# EAGLE design Controller Board v5 (EAGLE 5.06)
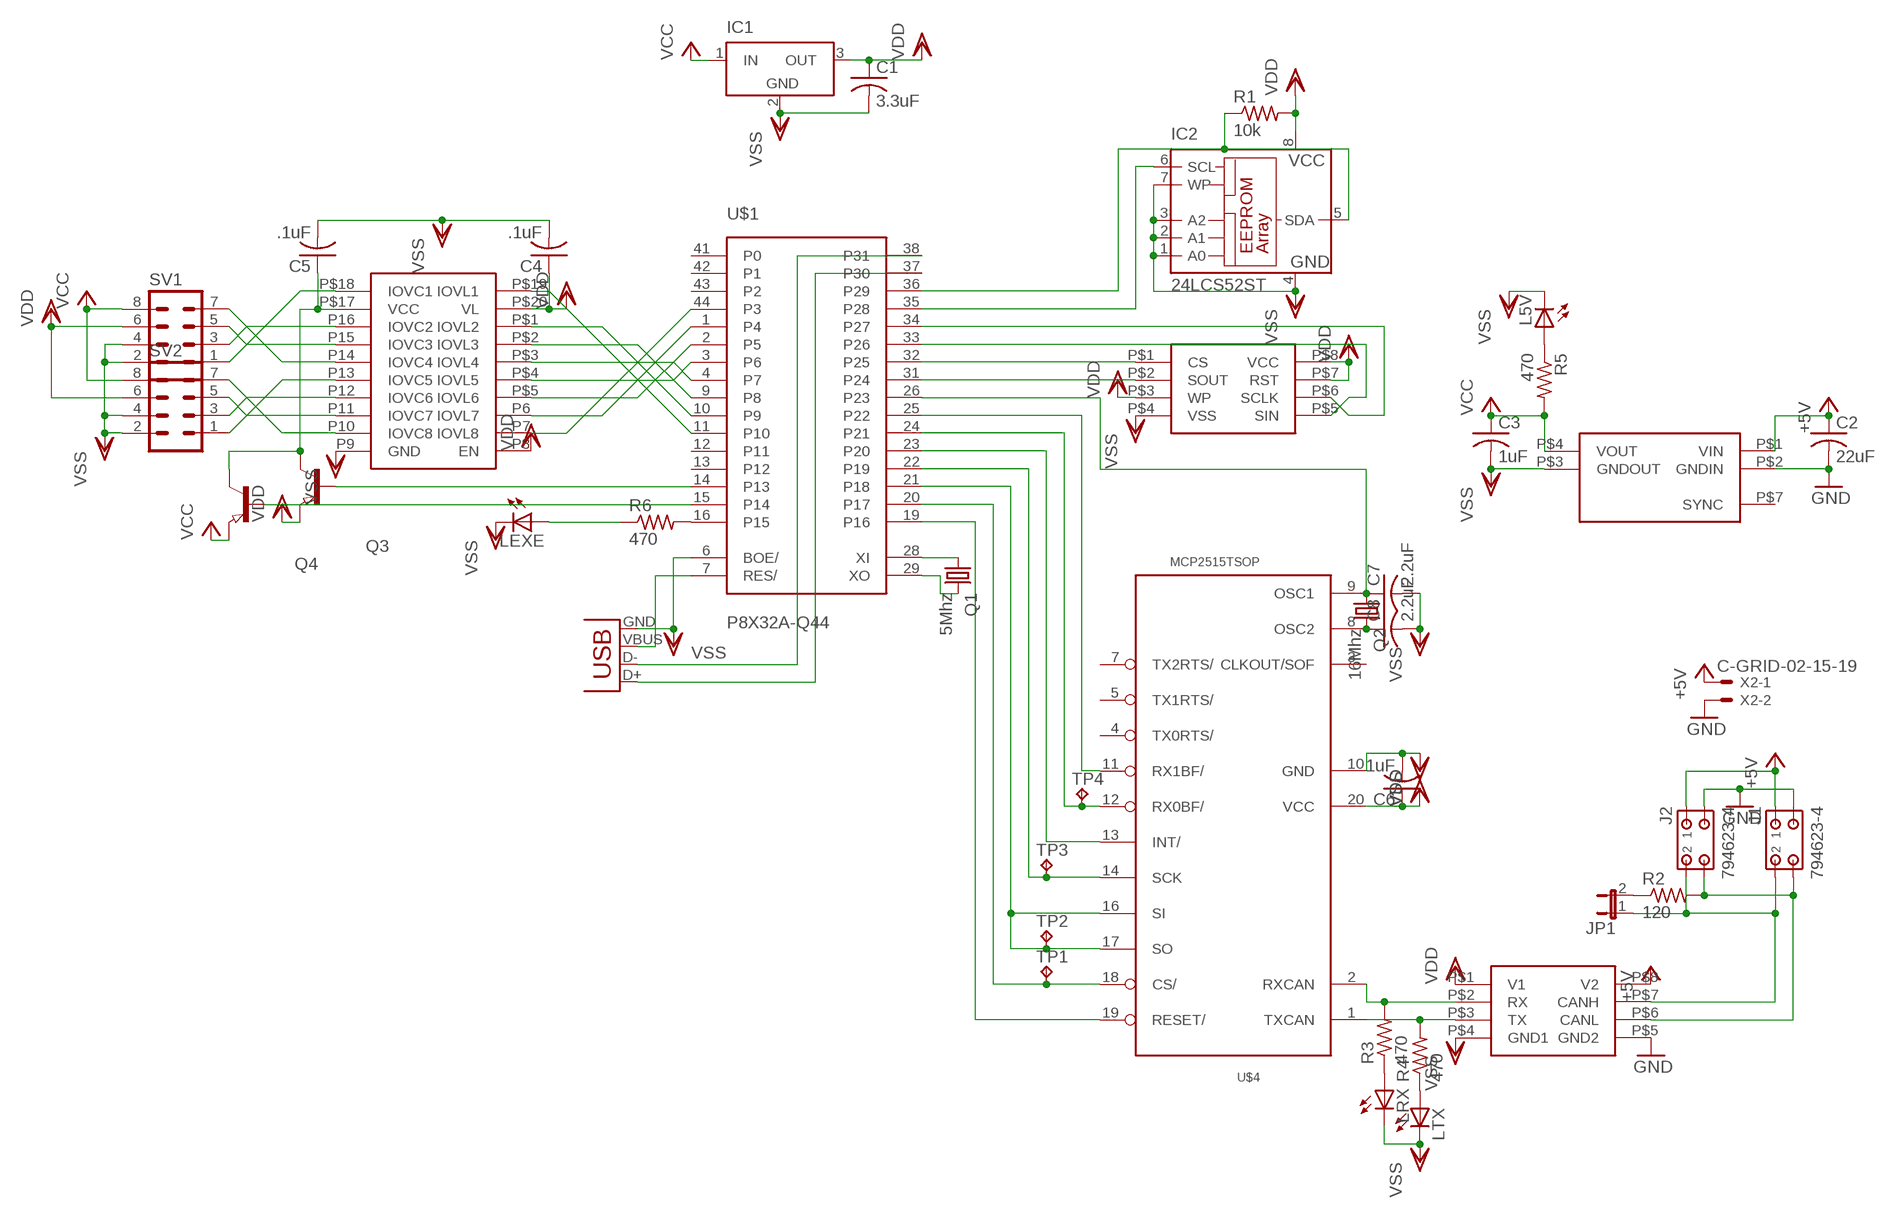
[diagram p0: schematic, sheet 1]

## Parts
C1  3.3uF  C-USC0805  [C0805]
C2  22uF  C-US050-024X044  [C050-024X044]
C3  1uF  C-USC0805  [C0805]
C4  .1uF  C-USC0805  [C0805]
C5  .1uF  C-USC0805  [C0805]
C6  1uF  C-USC0805  [C0805]
C7  2.2uF  C-USC0805  [C0805]
C8  2.2uF  C-USC0805  [C0805]
IC1  LT1129CST5  [SOT223]
IC2  24LCS52ST  [TSSOP8]
J1  794623-4  [794623-4]
J2  794623-4  [794623-4]
JP1  JP1E  [JP1]
L5V  LEDCHIP-LED0805  [CHIP-LED0805]
LEXE  LEDCHIP-LED0805  [CHIP-LED0805]
LRX  LEDCHIP-LED0805  [CHIP-LED0805]
LTX  LEDCHIP-LED0805  [CHIP-LED0805]
Q1  5Mhz  CRYSTALHC49UP  [HC49UP]
Q2  16Mhz  CRYSTALHC49UP  [HC49UP]
Q3  PNP-TRANSISTOR_SOT23  [SOT23]
Q4  PNP-TRANSISTOR_SOT23  [SOT23]
R1  10k  R-US_R0603  [R0603]
R2  120  R-US_R0603  [R0603]
R3  470  R-US_R0603  [R0603]
R4  470  R-US_R0603  [R0603]
R5  470  R-US_R0603  [R0603]
R6  470  R-US_R0603  [R0603]
SV1  MA04-2  [MA04-2]
SV2  MA04-2  [MA04-2]
TP1  TPPAD1-13  [P1-13]
TP2  TPPAD1-13  [P1-13]
TP3  TPPAD1-13  [P1-13]
TP4  TPPAD1-13  [P1-13]
U$1  P8X32A-Q44  [P8X32A-Q44]
U$2  TI-DCP020505  [PDIP14-7]
U$3  TI-ISO1050  [DUB-8]
U$4  MCP2515TSOP  [TSSOP20]
U$5  M25PE20  [S08N]
U$6  MAX3000E  [TQFN-20]
X1  USBSMD  [USB-MINIB]
X2  C-GRID-02-15-19  [15-91-02]

## Nets
+5V: C2.1 J1.1 J2.1 U$2.P$1(VIN) U$3.P$8(V2) X2.1
FLASHCLK: U$1.34(P27) U$5.P$6(SCLK)
FLASHSIN: U$1.33(P26) U$5.P$5(SIN)
GND: C2.2 J1.3 J2.3 U$2.P$2(GNDIN) U$3.P$5(GND2) X2.2
N$1: Q1.1 U$1.28(XI)
N$2: Q1.2 U$1.29(XO)
N$3: IC2.6(SCL) U$1.35(P28)
N$4: IC2.5(SDA) R1.1 U$1.36(P29)
N$5: U$1.7(RES/) X1.VBUS
N$6: U$1.38(P31) X1.D-
N$7: U$1.37(P30) X1.D+
N$8: U$1.25(P22) U$4.11(RX1BF/)
N$9: TP4.1(TP) U$1.24(P21) U$4.12(RX0BF/)
N$10: J1.4 J2.4 R2.2 U$3.P$6(CANL)
N$11: J1.2 J2.2 JP1.1 U$3.P$7(CANH)
N$14: U$1.32(P25) U$5.P$1(CS)
N$15: U$1.31(P24) U$5.P$2(SOUT)
N$16: U$1.23(P20) U$4.13(INT/)
N$17: TP3.1(TP) U$1.22(P19) U$4.14(SCK)
N$18: C7.1 Q2.1 U$1.26(P23) U$4.9(OSC1)
N$19: C8.1 Q2.2 U$4.8(OSC2)
N$20: R3.2 U$3.P$2(RX) U$4.2(RXCAN)
N$21: R4.2 U$3.P$3(TX) U$4.1(TXCAN)
N$22: JP1.2 R2.1
N$23: TP2.1(TP) U$1.21(P18) U$4.16(SI) U$4.17(SO)
N$24: TP1.1(TP) U$1.20(P17) U$4.18(CS/)
N$25: U$1.19(P16) U$4.19(RESET/)
N$26: LRX.A R3.1
N$27: U$1.11(P10) U$6.P$19(IOVL1)
N$28: SV2.7 U$6.P10(IOVC8)
N$29: SV2.5 U$6.P11(IOVC7)
N$30: U$1.10(P9) U$6.P$1(IOVL2)
N$31: U$1.9(P8) U$6.P$2(IOVL3)
N$32: U$1.4(P7) U$6.P$3(IOVL4)
N$33: U$1.3(P6) U$6.P$4(IOVL5)
N$34: U$1.2(P5) U$6.P$5(IOVL6)
N$35: U$1.1(P4) U$6.P6(IOVL7)
N$36: U$1.44(P3) U$6.P7(IOVL8)
N$37: SV2.3 U$6.P12(IOVC6)
N$38: SV2.1 U$6.P13(IOVC5)
N$39: SV1.7 U$6.P14(IOVC4)
N$40: SV1.1 U$6.P$18(IOVC1)
N$41: SV1.3 U$6.P16(IOVC2)
N$42: SV1.5 U$6.P15(IOVC3)
N$43: Q3.1(B) U$1.14(P13)
N$44: Q4.1(B) U$1.15(P14)
N$45: C5.1 Q3.3(C) Q4.3(C) U$6.P$17(VCC)
N$46: LTX.A R4.1
N$47: L5V.A R5.1
N$48: LEXE.A R6.1
N$49: R6.2 U$1.16(P15)
VCC: C3.1 IC1.1(IN) Q4.2(E) R5.2 SV1.8 SV2.8 U$2.P$4(VOUT)
VDD: C1.1 C4.1 C6.1 IC1.3(OUT) IC2.8(VCC) Q3.2(E) R1.2 SV1.6 SV2.6 U$3.P$1(V1) U$4.20(VCC) U$5.P$3(WP) U$5.P$7(RST) U$5.P$8(VCC) U$6.P8(EN) U$6.P$20(VL)
VSS: C1.2 C3.2 C4.2 C5.2 C6.2 C7.2 C8.2 IC1.2(GND) IC2.1(A0) IC2.2(A1) IC2.3(A2) IC2.4(GND) IC2.7(WP) L5V.C LEXE.C LRX.C LTX.C SV1.2 SV1.4 SV2.2 SV2.4 U$1.6(BOE/) U$2.P$3(GNDOUT) U$3.P$4(GND1) U$4.10(GND) U$5.P$4(VSS) U$6.P9(GND) X1.GND
Unconnected: U$1.12(P11) U$1.13(P12) U$1.41(P0) U$1.42(P1) U$1.43(P2) U$2.P$7(SYNC) U$4.3(CLKOUT/SOF) U$4.4(TX0RTS/) U$4.5(TX1RTS/) U$4.7(TX2RTS/)

## Power pins joined to a net without a drawn wire
VDD: U$1.8(VDD) U$1.18(VDD) U$1.30(VDD) U$1.40(VDD)
VSS: IC1.4(GND) U$1.5(VSS) U$1.17(VSS) U$1.27(VSS) U$1.39(VSS)

## Library data of the parts
C1-C8 = rcl:C-US: CAPACITOR, American symbol
IC1 = linear-technology:LT1129CST5: VOLTAGE REGULATOR with shutdown
IC2 = microchip:24*: Serial EEPROM I2C
J1 J2 = con-amp:794623-4: MICRO MATE N LOK Dual Row, grid 1.5 mm Source: http://catalog.tycoelectronics.com .. ENG_CD_794623_F.pdf
JP1 = jumper:JP1E: JUMPER
L5V LEXE LRX LTX = led:LED: LED OSRAM: - CHIPLED LG R971, LG N971, LY N971, LG Q971, LY Q971, LO R971, LY R971 LH N974, LH R974 LS Q976, LO Q976, LY Q976 LO Q996 - Hyper CHIPLED LW Q18S LB Q993, LB Q99A, LB R99A - SideLED LS A670, LO A670, LY A670, LG A670, LP A670 LB A673, LV A673, LT A673, LW A673 LH A674 LY A675 LS A676, LA A676, LO A676, LY A676, LW A676 LS A679, LY A679, LG A679 - Hyper Micro SIDELED® LS Y876, LA Y876, LO Y876, LY Y876 LT Y87S - SmartLED LW L88C, LW L88S LB L89C, LB L89S, LG L890 LS L89K, LO L89K, LY L89K LS L896, LA L896, LO L896, LY L896 - TOPLED LS T670, LO T670, LY T670, LG T670, LP T670 LSG T670, LSP T670, LSY T670, LOP T670, LYG T670 LG T671, LOG T671, LSG T671 LB T673, LV T673, LT T673, LW T673 LH T674 LS T676, LA T676, LO T676, LY T676, LB T676, LH T676, LSB T676, LW T676 LB T67C, LV T67C, LT T67C, LS T67K, LO T67K, LY T67K, LW E67C LS E67B, LA E67B, LO E67B, LY E67B, LB E67C, LV E67C, LT E67C LW T67C LS T679, LY T679, LG T679 LS T770, LO T770, LY T770, LG T770, LP T770 LB T773, LV T773, LT T773, LW T773 LH T774 LS E675, LA E675, LY E675, LS T675 LS T776, LA T776, LO T776, LY T776, LB T776 LHGB T686 LT T68C, LB T68C - Hyper Mini TOPLED® LB M676 - Mini TOPLED Santana® LG M470 LS M47K, LO M47K, LY M47K Source: http://www.osram.convergy.de LUXEON: - LUMILED® LXK2-PW12-R00, LXK2-PW12-S00, LXK2-PW14-U00, LXK2-PW14-V00 LXK2-PM12-R00, LXK2-PM12-S00, LXK2-PM14-U00 LXK2-PE12-Q00, LXK2-PE12-R00, LXK2-PE12-S00, LXK2-PE14-T00, LXK2-PE14-U00 LXK2-PB12-K00, LXK2-PB12-L00, LXK2-PB12-M00, LXK2-PB14-N00, LXK2-PB14-P00, LXK2-PB14-Q00 LXK2-PR12-L00, LXK2-PR12-M00, LXK2-PR14-Q00, LXK2-PR14-R00 LXK2-PD12-Q00, LXK2-PD12-R00, LXK2-PD12-S00 LXK2-PH12-R00, LXK2-PH12-S00 LXK2-PL12-P00, LXK2-PL12-Q00, LXK2-PL12-R00 Source: www.luxeon.com KINGBRIGHT: KA-3528ASYC Source: www.kingbright.com
Q1 Q2 = crystal:CRYSTAL: CRYSTAL
Q3 Q4 = semicon-smd-ipc:PNP-TRANSISTOR_: PNP TRANSISTOR
R1-R6 = rcl:R-US_: RESISTOR, American symbol
SV1 SV2 = con-lstb:MA04-2: PIN HEADER
TP1-TP4 = testpad:TP: Test pad
U$1 = parallax_propeller:P8X32A-Q44
U$2 = isodcdc:TI-DCP020505
U$3 = isodcdc:TI-ISO1050
U$4 = MCP2515_MT:MCP2515*: MCP2515 Standalone CAN-Controller by Microchip Eagle-Lib. by MartinThomas
U$5 = Flash:M25PE20
U$6 = Level Shifters:MAX3000E
X1 = SparkFun:USB: USB Connectors USB-B-PTH is fully proven SKU : PRT-00139 USB-miniB is fully proven SKU : PRT-00587 USB-A-PCB is untested. USB-A-H is throughly reviewed, but untested. Spark Fun Electronics SKU : PRT-00437 USB-B-SMT is throughly reviewed, but untested. Needs silkscreen touching up. USB-A-S has not been used/tested USB-MB-H has not been used/tested
X2 = con-molex:C-GRID-02: CONNECTOR wire to board 2.54 mm (0.100") pitch header

## Board
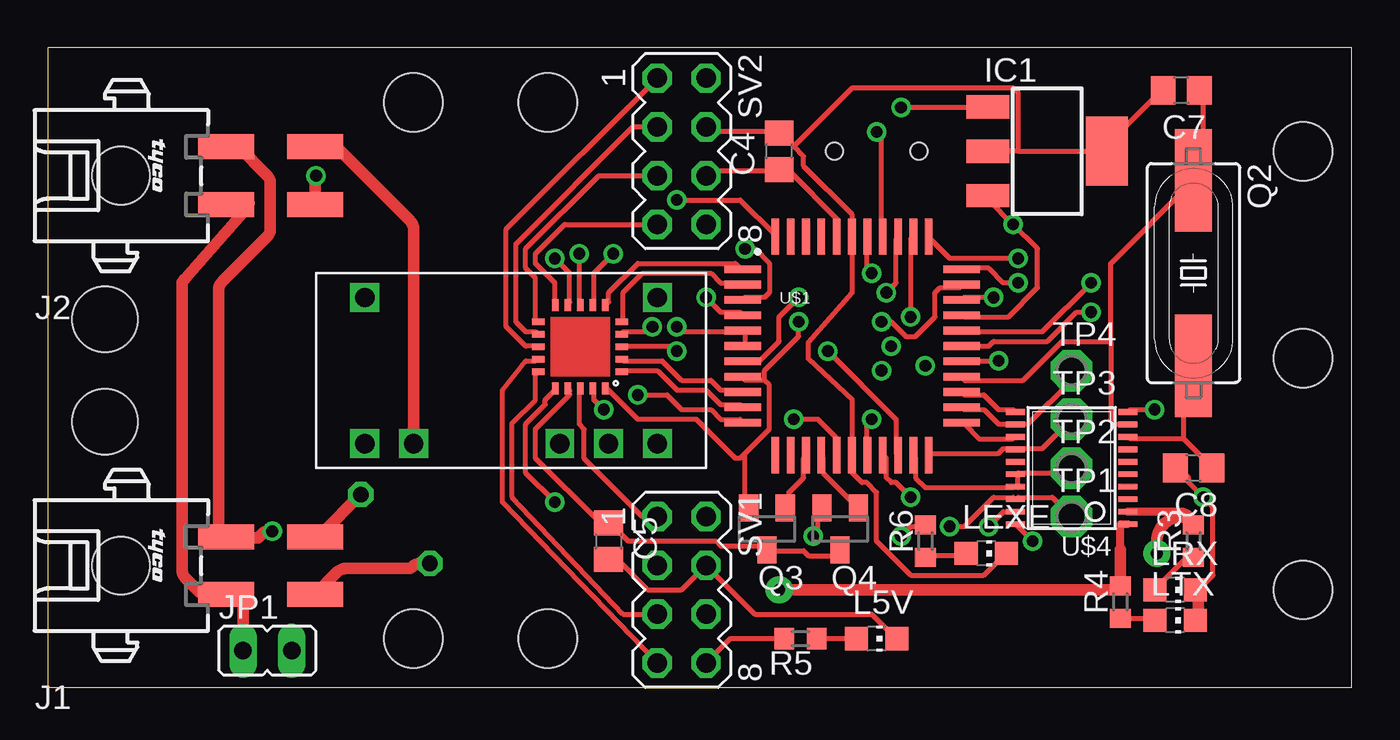
[diagram p1: board, top side]
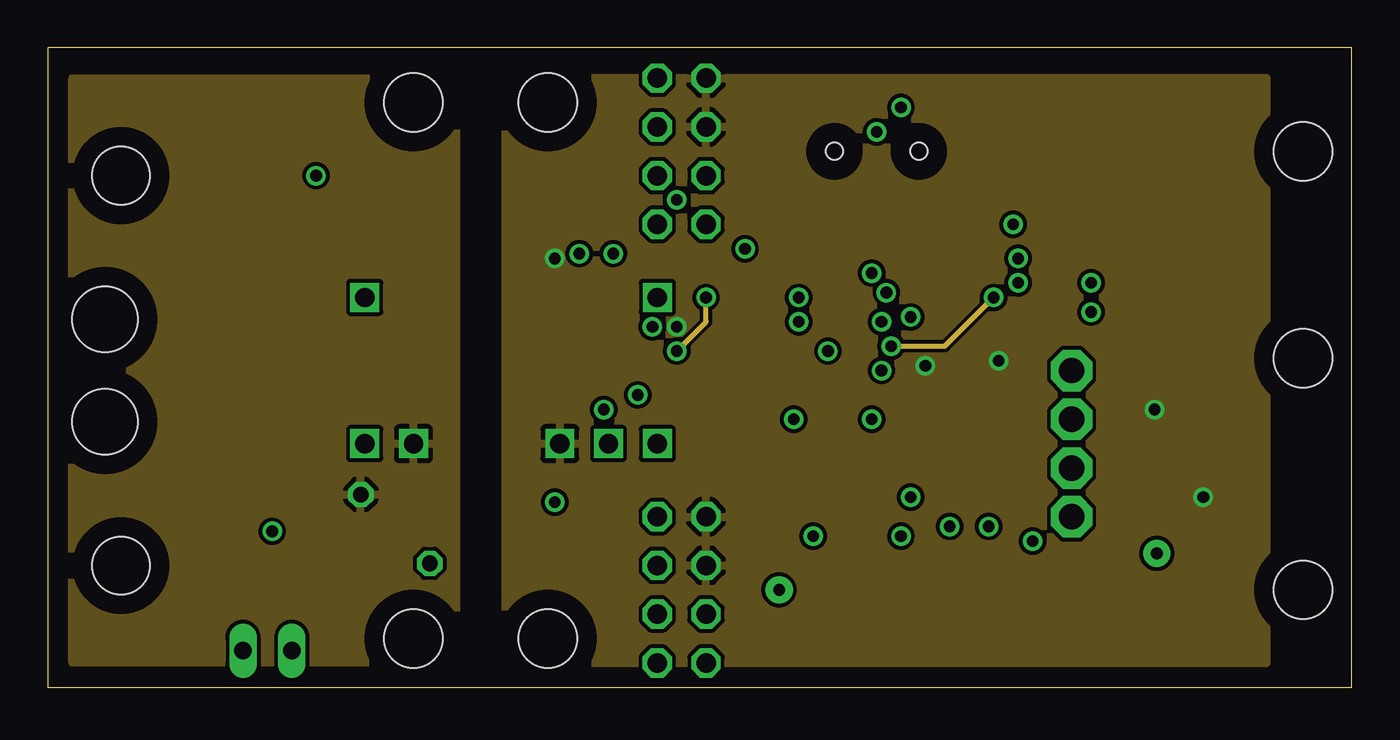
[diagram p2: board, inner layer Route2]
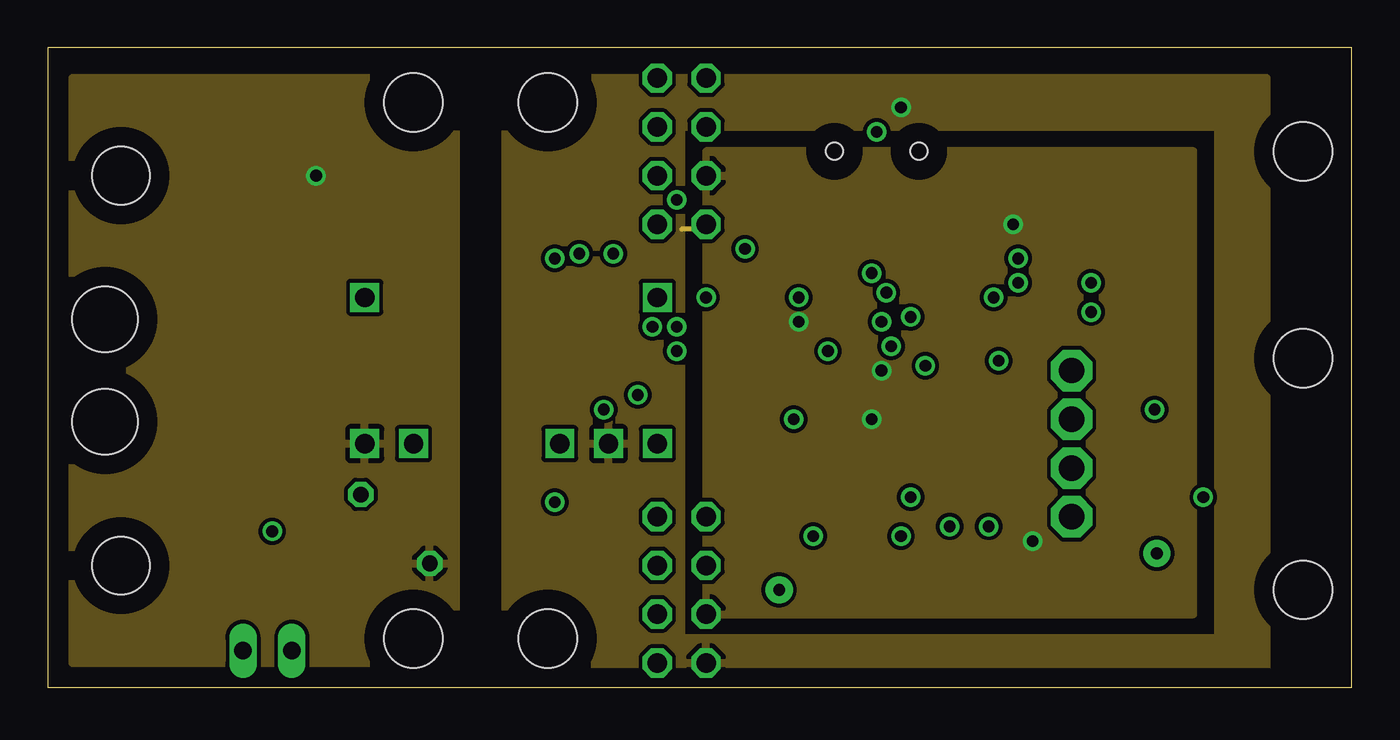
[diagram p3: board, inner layer Route15]
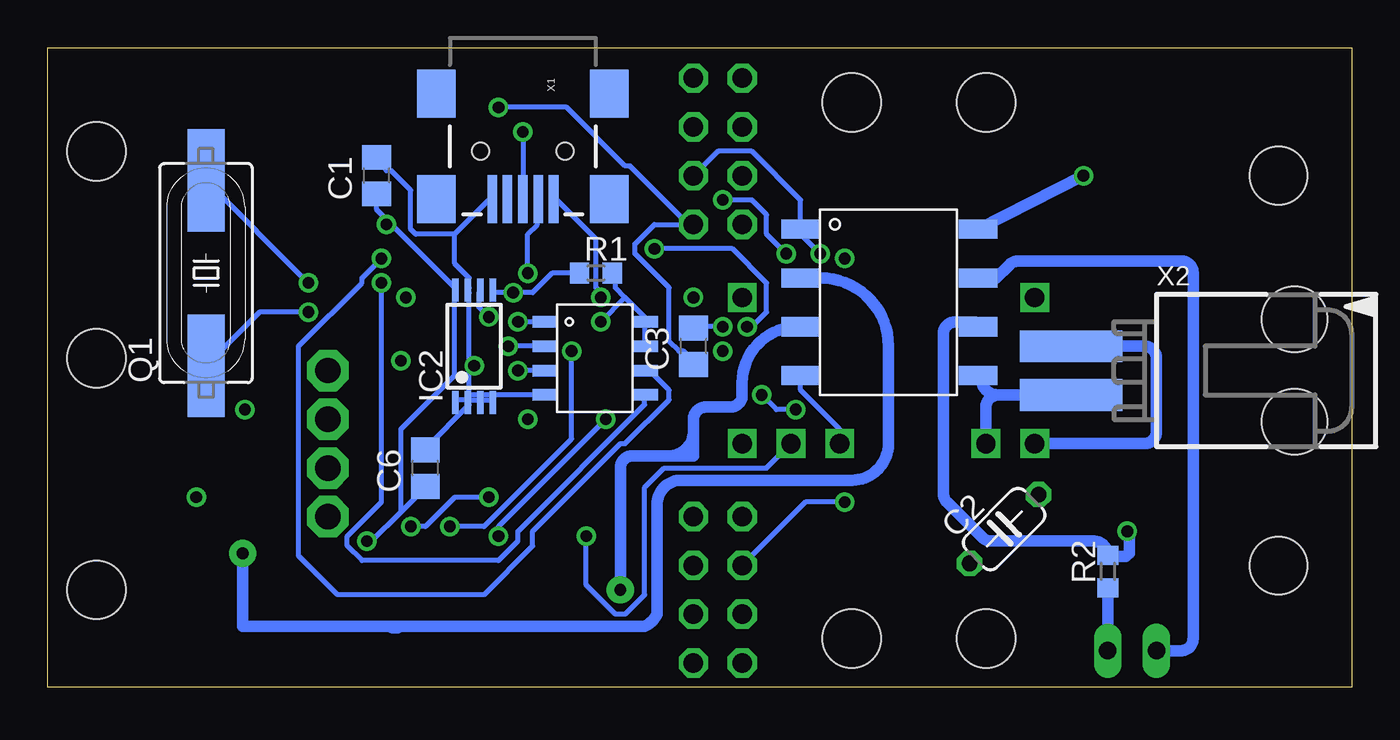
[diagram p4: board, bottom side, seen from below]

Size 67.92 x 33.33 mm. Coordinates in mm from the lower left corner, seen from the top.
Outline: 0,0 67.92,0 67.92,33.33 0,33.33 0,0
Copper layers (1*2+15*16): Top 0.035mm / dielectric 0.2mm / Route2 0.035mm / dielectric 1.5mm / Route15 0.035mm / dielectric 0.2mm / Bottom 0.035mm
Design rules "4 layer": minimum track width 10mil, minimum drill 24mil, track to track 8mil, track to pad 8mil, pad to pad 8mil, via to via 8mil, smd to smd 8mil, copper to edge 40mil, drill to drill 8mil, minimum pad ring 10mil, minimum via ring 8mil, stop-mask expansion 4mil, vias tented up to drill 0mil, thermal gap 10mil
Holes 3.05 mm at 65.41,5.08 65.41,27.94 26.04,30.48 26.04,2.54 65.41,17.14 19.05,30.48 19.05,2.54
tRestrict: area 22.2,3.8 to 22.9,29.8

### Footprints (pad centres in the part's own frame; a part is rotated, then mirrored left to right if it is on the bottom)
C0805 = smd 1.3 x 1.5: 1 -0.95,0; 2 0.95,0
C050-024X044 = drill 0.813 octagon: 1 -2.54,0; 2 2.54,0
SOT223 = smd 1.219 x 2.235: 1 -2.311,-3.099; 2 0,-3.099; 3 2.311,-3.099 | smd 3.6 x 2.2: 4 0,3.099
TSSOP8 = smd 0.35 x 1.2: 1 -0.975,-2.925; 2 -0.325,-2.925; 3 0.325,-2.925; 4 0.975,-2.925; 5 0.975,2.925; 6 0.325,2.925; 7 -0.325,2.925; 8 -0.975,2.925
794623-4 = smd 1.3 x 2.92: 1 1.5,10.1; 2 1.5,5.48; 3 -1.5,10.1; 4 -1.5,5.48 | hole 3: 0,0
JP1 = drill 0.914 long: 1 0,-1.27; 2 0,1.27
CHIP-LED0805 = smd 1.2 x 1.2: A 0,-1.05; C 0,1.05
HC49UP = smd 5.334 x 1.93: 1 -4.826,0; 2 4.826,0
SOT23 = smd 1 x 1.4: 1 -0.95,-1.1; 2 0.95,-1.1; 3 0,1.1
R0603 = smd 1 x 1.1: 1 -0.85,0; 2 0.85,0
MA04-2 = drill 1.016 octagon: 1 -3.81,-1.27; 2 -3.81,1.27; 3 -1.27,-1.27; 4 -1.27,1.27; 5 1.27,-1.27; 6 1.27,1.27; 7 3.81,-1.27; 8 3.81,1.27
P1-13 = drill 1.321 pad 2.159 octagon: 1 0,0
P8X32A-Q44 = smd 1.9 x 0.4: 1 -5.713,4.013; 2 -5.713,3.212; 3 -5.713,2.413; 4 -5.713,1.613; 5 -5.713,0.812; 6 -5.713,0.013; 7 -5.713,-0.787; 8 -5.713,-1.587; 9 -5.713,-2.388; 10 -5.713,-3.188; 11 -5.713,-3.987; 23 5.688,-3.987; 24 5.688,-3.188; 25 5.688,-2.388; 26 5.688,-1.587; 27 5.688,-0.787; 28 5.688,0.013; 29 5.688,0.812; 30 5.688,1.613; 31 5.688,2.413; 32 5.688,3.212; 33 5.688,4.013 | smd 0.4 x 1.9: 12 -4.013,-5.688; 13 -3.212,-5.688; 14 -2.413,-5.688; 15 -1.613,-5.688; 16 -0.812,-5.688; 17 -0.013,-5.688; 18 0.787,-5.688; 19 1.587,-5.688; 20 2.388,-5.688; 21 3.188,-5.688; 22 3.987,-5.688; 34 3.987,5.713; 35 3.188,5.713; 36 2.388,5.713; 37 1.587,5.713; 38 0.787,5.713; 39 -0.013,5.713; 40 -0.812,5.713; 41 -1.613,5.713; 42 -2.413,5.713; 43 -3.212,5.713; 44 -4.013,5.713
PDIP14-7 = drill 1 square: P$1 -8.89,-3.81; P$2 -6.35,-3.81; P$3 1.27,-3.81; P$4 3.81,-3.81; P$5 6.35,-3.81; P$6 6.35,3.81; P$7 -8.89,3.81
DUB-8 = smd 2 x 1: P$1 -4.572,3.556; P$2 -4.572,1.016; P$3 -4.572,-1.524; P$4 -4.572,-4.064; P$5 4.678,-4.064; P$6 4.678,-1.524; P$7 4.678,1.016; P$8 4.678,3.556
TSSOP20 = smd 0.305 x 0.991: 1 -2.925,-2.918; 2 -2.275,-2.918; 3 -1.625,-2.918; 4 -0.975,-2.918; 5 -0.325,-2.918; 6 0.325,-2.918; 7 0.975,-2.918; 8 1.625,-2.918; 9 2.275,-2.918; 10 2.925,-2.918; 11 2.925,2.918; 12 2.275,2.918; 13 1.625,2.918; 14 0.975,2.918; 15 0.325,2.918; 16 -0.325,2.918; 17 -0.975,2.918; 18 -1.625,2.918; 19 -2.275,2.918; 20 -2.925,2.918
S08N = smd 0.6 x 1.3: P$1 -2.54,-2.667; P$2 -1.27,-2.667; P$3 0,-2.667; P$4 1.27,-2.667; P$5 1.27,2.587; P$6 0,2.587; P$7 -1.27,2.587; P$8 -2.54,2.587
TQFN-20 = smd 0.65 x 0.35: P6 0.875,-1.1; P7 0.875,-0.45; P8 0.875,0.2; P9 0.875,0.85; P10 0.875,1.5; P16 -3.475,1.5; P$17 -3.475,0.85; P$18 -3.475,0.2; P$19 -3.475,-0.45; P$20 -3.475,-1.1 | smd 0.35 x 0.65: P11 0,2.4; P12 -0.65,2.4; P13 -1.3,2.4; P14 -1.95,2.4; P15 -2.6,2.4; P$1 -2.6,-1.95; P$2 -1.95,-1.95; P$3 -1.3,-1.95; P$4 -0.65,-1.95; P$5 0,-1.95
USB-MINIB = smd 2.5 x 0.5: D+ 2.5,0; D- 2.5,0.8; GND 2.5,-1.6; ID 2.5,-0.8; VBUS 2.5,1.6 | smd 2.5 x 2: GND@1 -3,-4.5; GND@2 -3,4.5; GND@3 2.5,4.5; GND@4 2.5,-4.5 | hole 0.9: 0,2.2; 0,-2.2
15-91-02 = smd 1.651 x 5.334: 1 -1.27,-10.795; 2 1.27,-10.795 | hole 3.404: -2.667,0.838; 2.667,0.838

### Placement (x,y rotation side)
C1  50.8,26.67 90 bottom
C2  18.1,8.26 45 bottom
C3  34.29,17.78 90 bottom
C4  38.1,27.94 90 top
C5  29.21,7.62 270 top
C6  48.26,11.43 90 bottom
C7  59.05,31.11 180 top
C8  59.69,11.43 180 top
IC1  52.07,27.94 270 top
IC2  45.72,17.78 0 bottom
J1  3.81,6.35 270 top
J2  3.81,26.67 270 top
JP1  11.43,1.91 270 top
L5V  43.18,2.54 270 top
LEXE  48.9,6.99 270 top
LRX  58.74,5.08 270 top
LTX  58.74,3.49 270 top
Q1  59.69,21.59 90 bottom
Q2  59.69,21.59 270 top
Q3  37.47,8.26 180 top
Q4  41.27,8.26 180 top
R1  39.37,21.59 0 bottom
R2  12.7,6.03 90 bottom
R3  59.69,7.62 90 top
R4  55.88,4.45 90 top
R5  39.21,2.54 180 top
R6  45.72,7.62 90 top
SV1  33.02,5.08 270 top
SV2  33.02,27.94 270 top
TP1  53.34,8.89 0 top
TP2  53.34,11.43 0 top
TP3  53.34,13.97 0 top
TP4  53.34,16.51 0 top
U$1  41.91,17.78 0 top
U$2  25.4,16.51 0 top
U$3  24.13,20.32 0 bottom
U$4  53.34,11.43 90 top
U$5  39.37,16.51 270 bottom
U$6  27.94,19.05 90 top
X1  43.18,27.94 270 bottom
X2  3.81,16.51 270 bottom

### Tracks (layer width: path | path; a pad name or v marks a point on that pad's centre or on a via)
+5V  (via drill 0.61)
  Top 0.254: J2.1 13.97,25.4
  Top 0.61: v13.97,26.67 13.91,26.61 J2.1 | J1.1 15.06,6 arc-45 15.51,6.19 18.78,6.19 arc45 18.97,6.27 arc-45 19.42,6.46 C2.1
  Bottom 0.61: v13.97,26.67 U$3.P$8 | X2.1 10.79,17.78 arc90 10.16,17.14 10.16,13.34 arc90 10.79,12.7 U$2.P$1
  pour Route15: 1.27,31.75 1.27,1.27 21.27,1.27 21.27,31.75
FLASHCLK  (via drill 0.61)
  Top 0.254: v50.55,22.35 46.99,22.35 45.97,23.37 U$1.34
  Bottom 0.254: v50.55,22.35 51.56,21.34 51.56,21.08 54.86,17.78 54.86,6.86 52.83,4.83 45.21,4.83 42.67,7.37 42.67,8.13 38.1,12.7 37.85,12.7 35.56,14.99 35.56,15.49 36.58,16.51 U$5.P$6
FLASHSIN  (via drill 0.61)
  Top 0.254: v50.55,21.08 49.78,21.08 49.02,21.84 47.75,21.84 U$1.33
  Bottom 0.254: v50.55,21.08 50.55,9.65 52.32,7.87 52.32,7.37 51.56,6.6 44.45,6.6 43.43,7.62 43.43,8.13 36.83,14.73 36.83,15.24 U$5.P$5
GND
  Top 0.254: J1.3 13.97,7.87
  Top 0.61: J2.3 13.98,28.1 15.08,28.1 18.86,24.32 arc-45 19.05,23.87 U$2.P$2 | 13.97,7.87 arc45 14.23,7.98 C2.2
  Bottom 0.254: 19.3,16.26 U$3.P$5
  Bottom 0.61: X2.2 18.41,15.24 | 18.41,15.24 arc-90 19.05,14.61 U$2.P$2 | 19.3,16.26 19.3,16.13 arc-90 18.41,15.24
  pour Route2: 21.27,31.75 21.27,1.27 1.27,1.27 1.27,31.75
N$1  (via drill 0.61)
  Top 0.254: v54.36,19.56 53.59,19.56 52.07,18.03 49.28,18.03 49.02,17.78 47.75,17.78 U$1.28
  Bottom 0.254: v54.36,19.56 56.9,19.56 Q1.1
N$2  (via drill 0.61)
  Top 0.254: v54.36,21.08 51.82,18.54 47.75,18.54 U$1.29
  Bottom 0.254: v54.36,21.08 Q1.2
N$3  (via drill 0.61)
  Top 0.254: v44.96,19.3 44.96,23.37 U$1.35
  Bottom 0.254: v44.96,19.3 45.47,19.81 45.47,20.57 IC2.6
N$4  (via drill 0.61)
  Top 0.254: v43.69,20.57 44.2,21.08 44.2,23.37 U$1.36
  Bottom 0.254: R1.1 41.66,21.59 42.67,20.57 v43.69,20.57 44.7,20.57 IC2.5
N$5  (via drill 0.61)
  Top 0.254: v39.12,20.32 38.1,19.3 38.1,18.03 37.08,17.02 36.32,17.02 U$1.7
  Bottom 0.254: v39.12,20.32 39.12,20.57 39.37,20.83 39.37,23.37 41.4,25.4 X1.VBUS
N$6  (via drill 0.61)
  Top 0.254: v42.93,21.59 42.67,21.84 42.67,23.37 U$1.38
  Bottom 0.254: v42.93,21.59 42.93,23.62 42.42,24.13 42.42,25.4 X1.D-
N$7  (via drill 0.61)
  Top 0.254: v43.18,28.96 43.43,28.7 43.43,23.62 U$1.37
  Bottom 0.254: v43.18,28.96 X1.D+
N$8
  Top 0.254: U$4.11 50.29,14.48 49.53,14.48 48.77,15.24 47.75,15.24 U$1.25
N$9
  Top 0.254: U$1.24 47.75,14.48 48.77,14.48 49.53,13.72 50.29,13.72 U$4.12 50.55,13.72 51.05,13.72 53.34,16 TP4.1
N$10  (via drill 0.61)
  Top 0.254: J2.4 9.4,27.94 | 9.4,7.87 9.4,8.13 J1.4 9.4,7.87
  Top 0.61: 9.4,8.13 9.02,8.13 8.89,8.26 8.89,20.69 arc-45 9.08,21.14 11.4,23.47 arc45 11.59,23.92 11.59,26.25 arc45 11.4,26.7 9.93,28.17 J2.4 | v11.68,8.13 11.59,8.1 11.27,8.1 10.95,7.78 9.37,7.78 J1.4
  Bottom 0.61: v11.68,8.13 11.59,8.1 11.59,6.99 11.75,6.83 12.54,6.83 R2.2 arc-90 13.44,7.62 18.79,7.62 arc45 19.24,7.81 21.09,9.66 arc45 21.27,10.11 21.27,18.41 arc90 20.64,19.05 19.68,19.05 arc90 19.45,18.82 U$3.P$6
N$11
  Top 0.254: J1.2 9.4,5.08 | J1.2 9.4,4.83 | JP1.1 10.16,2.03 | J2.2 9.14,25.15 | J1.2 9.14,5.08
  Top 0.61: J2.2 9.37,25.24 10.48,25.24 10.32,24.92 7.14,21.29 arc18 6.99,21.11 6.99,20.32 6.99,6.14 arc45 7.17,5.69 7.94,4.92 9.21,4.92 J1.2 9.53,4.92 10,4.92 10.16,4.76 JP1.1
  Bottom 0.61: U$3.P$7 19.37,21.27 18.57,21.27 17.81,22.04 arc45 17.36,22.23 8.89,22.23 arc90 8.26,21.59 8.26,2.54 arc90 8.89,1.91 JP1.1
N$14  (via drill 0.61)
  Top 0.254: v43.43,19.05 43.94,19.05 44.7,18.29 45.21,18.29 46.23,19.3 46.23,20.57 46.48,20.83 47.5,20.83 U$1.32
  Bottom 0.254: U$5.P$1 v43.43,19.05
N$15  (via drill 0.61)
  Top 0.254: v49.28,20.32 47.75,20.32 U$1.31
  Route2 0.254: v43.94,17.78 46.74,17.78 v49.28,20.32
  Bottom 0.254: U$5.P$2 v43.94,17.78
N$16
  Top 0.254: U$4.13 50.29,12.95 48.51,12.95 47.75,13.72 U$1.23
N$17
  Top 0.254: TP3.1 51.82,12.45 50.55,12.45 U$4.14 50.29,12.45 49.78,12.45 49.53,12.19 45.97,12.19 U$1.22
N$18
  Top 0.254: 55.37,18.03 55.37,22.1 Q2.1 60.2,26.92 | 55.37,18.03 55.37,13.97 55.63,13.72 56.13,13.72 U$4.9 | 60.2,26.92 60.45,27.18 | 55.37,18.03 52.83,18.03 50.8,16 47.75,16 U$1.26 | 60.2,26.92 60.2,30.99 C7.1
N$19
  Top 0.254: 59.18,12.95 56.39,12.95 U$4.8 | 59.18,12.95 60.71,11.43 C8.1 | 59.18,12.95 59.18,16.26 Q2.2
N$20  (via drill 0.61 pad 1.42)
  Top 0.406: U$4.2 59.01,9.15 arc-90 R3.2
  Top 0.61: R3.2 arc90 59.91,8.26 | R3.2 59.69,8.26 | v57.78,6.99 57.78,7.62 arc-90 59.05,8.89 59.27,8.89 arc-90 R3.2
  Bottom 0.61: U$3.P$2 27.69,21.34 arc90 24.13,17.78 24.13,12.7 arc90 26.04,10.79 34.92,10.79 arc-90 36.2,9.53 36.2,5.08 | 49.53,3.17 36.83,3.17 arc-37 36.2,3.81 36.2,5.08 | 49.53,3.17 50.16,3.17 | 50.16,3.17 57.78,3.17 v57.78,6.99 | 49.53,3.17 arc53 50.16,3.17 | 36.2,5.08 36.2,4.45
N$21  (via drill 0.61 pad 1.42)
  Top 0.406: 55.88,7.2 55.88,8.51 U$4.1
  Top 0.61: v38.1,5.08 55.88,5.08 55.88,7.2 R4.2
  Bottom 0.61: U$3.P$3 28.83,18.8 arc-90 31.75,15.88 31.75,15.24 arc90 32.38,14.61 33.66,14.61 arc-90 34.29,13.97 34.29,13.34 | 34.29,13.34 34.29,12.06 35.56,12.06 | 35.56,12.06 37.47,12.06 arc-90 38.1,11.43 v38.1,5.08 | 35.56,12.06 arc-90 34.29,13.34
N$22
  Bottom 0.61: JP1.2 R2.1
N$23
  Top 0.254: 50.55,11.18 50.55,10.41 U$4.17 50.29,10.41 45.72,10.41 45.21,10.92 45.21,11.94 U$1.21 | 50.55,11.18 53.09,11.18 TP2.1 | 50.55,11.18 U$4.16
N$24  (via drill 0.61)
  Top 0.254: TP1.1 52.32,9.91 50.55,9.91 U$4.18 50.29,9.91 49.28,9.91 47.75,8.38 v46.99,8.38 | v40.64,17.53 44.2,13.97 44.2,12.19 U$1.20
  Bottom 0.254: v40.64,17.53 40.64,12.95 45.21,8.38 v46.99,8.38
N$25  (via drill 0.61)
  Top 0.254: v49.02,8.38 49.78,9.14 50.29,9.14 U$4.19 | v44.96,9.91 44.2,10.67 43.94,10.67 43.69,10.92 43.69,11.94 U$1.19
  Bottom 0.254: v49.02,8.38 48.26,8.38 46.74,9.91 v44.96,9.91
N$26
  Top 0.254: R3.1 59.69,6.6 59.18,6.6 57.66,5.08 LRX.A
N$27  (via drill 0.61)
  Top 0.254: v28.96,14.48 28.45,14.99 28.45,15.49 U$6.P$19 | v30.73,15.24 32.26,15.24 33.02,14.48 34.54,14.48 35.05,13.97 36.07,13.97 U$1.11
  Bottom 0.254: v28.96,14.48 29.97,14.48 v30.73,15.24
N$28
  Top 0.254: SV2.7 26.92,24.13 25.4,22.61 25.4,22.1 26.42,21.08 26.42,20.07 U$6.P10
N$29
  Top 0.254: SV2.5 28.7,26.67 24.89,22.86 24.89,21.84 25.4,21.34 25.4,19.05 U$6.P11
N$30
  Top 0.254: U$6.P$1 29.97,16.51 31.75,16.51 32.77,15.49 34.29,15.49 35.05,14.73 36.07,14.73 U$1.10
N$31
  Top 0.254: U$6.P$2 29.97,17.02 32,17.02 33.02,16 34.54,16 35.05,15.49 36.07,15.49 U$1.9
N$32  (via drill 0.61)
  Top 0.254: v32.77,17.53 32.51,17.78 29.97,17.78 U$6.P$3 | v34.29,20.32 35.05,19.56 36.07,19.56 U$1.4
  Route2 0.254: v32.77,17.53 34.29,19.05 v34.29,20.32
N$33  (via drill 0.61)
  Top 0.254: v31.5,18.8 31.24,18.54 29.97,18.54 U$6.P$4 | v36.32,22.86 36.83,22.86 37.59,22.1 37.59,20.57 37.34,20.32 36.32,20.32 U$1.3
  Bottom 0.254: v31.5,18.8 31.24,18.8 30.48,19.56 30.48,21.08 32.26,22.86 v36.32,22.86
N$34
  Top 0.254: U$6.P$5 29.97,19.05 29.97,20.57 30.99,21.59 34.54,21.59 35.05,21.08 36.07,21.08 U$1.2
N$35
  Top 0.254: U$6.P6 29.21,20.07 29.21,20.57 30.73,22.1 35.81,22.1 36.07,21.84 U$1.1
N$36  (via drill 0.61)
  Top 0.254: v29.46,22.61 28.45,21.59 28.45,20.07 U$6.P7 | v32.77,25.4 36.07,25.4 37.85,23.62 U$1.44
  Bottom 0.254: v29.46,22.61 30.48,23.62 30.48,24.64 31.24,25.4 v32.77,25.4
N$37
  Top 0.254: SV2.3 30.48,29.21 24.38,23.11 24.38,19.05 24.89,18.54 25.4,18.54 U$6.P12
N$38
  Top 0.254: SV2.1 23.88,23.88 23.88,18.8 24.89,17.78 25.4,17.78 U$6.P13
N$39
  Top 0.254: SV1.7 23.69,9.65 23.69,15.49 24.89,17.02 25.4,17.02 U$6.P14
N$40
  Top 0.254: SV1.1 30.99,8.89 27.94,11.94 27.94,13.46 27.69,13.72 27.69,15.49 U$6.P$18
N$41  (via drill 0.61)
  Top 0.254: v26.42,9.65 24.89,11.18 24.89,13.72 25.91,14.73 25.91,14.99 26.42,15.49 U$6.P16
  Bottom 0.254: v26.42,9.65 28.45,9.65 SV1.3
N$42
  Top 0.254: SV1.5 29.97,3.81 24.19,9.91 24.19,13.78 25.4,14.99 25.4,16.51 U$6.P15
N$43
  Top 0.254: Q3.1 38.61,9.4 38.61,10.16 39.37,10.92 39.37,11.94 U$1.14
N$44
  Top 0.254: Q4.1 42.16,9.4 40.39,11.18 40.39,11.94 U$1.15
N$45
  Top 0.254: Q4.3 41.15,7.11 40.89,6.86 39.62,6.86 39.37,7.11 37.59,7.11 Q3.3 37.34,7.37 35.05,7.37 34.8,7.62 30.23,7.62 29.21,8.64 | 29.21,8.64 28.7,8.64 25.4,11.94 25.4,13.46 27.18,15.24 27.18,15.49 U$6.P$17 | C5.1 29.21,8.64
N$46
  Top 0.254: R4.1 55.88,3.56 57.66,3.56 LTX.A
N$47
  Top 0.254: R5.1 L5V.A
N$48
  Top 0.254: R6.1 45.72,6.86 47.75,6.86 LEXE.A
N$49  (via drill 0.61)
  Top 0.254: v44.45,7.87 44.96,8.38 45.72,8.38 R6.2 | v38.86,13.97 40.13,13.97 41.15,12.95 41.15,12.19 U$1.16
  Bottom 0.254: v44.45,7.87 44.45,8.38 v38.86,13.97
VCC  (via drill 0.61)
  Top 0.254: v44.45,30.23 48.77,30.23 IC1.1 | v39.88,7.87 40.13,8.13 40.13,9.14 Q4.2 | SV1.8 35.56,2.54 R5.2
  Route15 0.254: 33.02,23.88 34.04,23.88 SV2.8
  Bottom 0.254: 34.54,24.13 36.32,24.13 37.34,23.11 37.34,22.61 35.56,20.83 35.56,18.03 35.05,17.53 34.8,17.53 34.29,17.02 C3.1 | v44.45,30.23 40.89,30.23 37.85,27.18 37.59,27.18 34.54,24.13 | 34.54,24.13 SV2.8 | v39.88,7.87 39.88,5.33 38.35,3.81 37.85,3.81 36.83,4.83 36.83,10.41 35.81,11.43 30.48,11.43 U$2.P$4
  pour Route15: 23.81,31.75 23.81,0.32 63.5,0 63.5,2.54 33.02,2.54 33.02,31.75
  pour Route15: 33.02,31.75 33.02,29.21 60.96,29.21 60.96,1.27 63.5,1.27 63.5,31.75
  pour Route15: 23.81,2.54 23.81,0 63.5,0 63.5,2.54
VDD  (via drill 0.61)
  Top 0.254: U$6.P$20 29.21,15.49 30.73,13.97 33.78,13.97 35.81,11.94 36.07,11.94 36.32,12.19 | 37.34,16 36.32,16 U$1.8 | 37.34,16 37.59,15.75 37.59,13.46 36.32,12.19 | U$1.30 47.75,19.3 50.04,19.3 51.56,20.83 51.56,22.86 v50.29,24.13 49.02,25.4 IC1.3 | v27.69,22.61 27.69,20.07 U$6.P8 | v51.31,7.62 50.55,8.38 U$4.20 | 38.1,26.92 34.54,26.92 SV2.6 | v42.93,13.97 42.67,13.72 42.67,12.19 U$1.18 | 38.1,26.92 38.61,26.92 41.15,24.38 41.15,23.62 U$1.40 | 38.1,26.92 C4.1 | 37.34,16 37.34,16.51 39.12,18.29 v39.12,19.05 | 36.32,12.19 36.32,9.4 Q3.2
  Bottom 0.254: C1.1 50.8,24.89 46.74,20.83 IC2.8 46.74,20.57 46.74,16.26 49.53,13.46 49.53,9.14 | 37.85,20.32 36.58,19.05 U$5.P$8 36.83,19.05 36.83,17.78 U$5.P$7 | 37.85,20.32 38.35,20.83 38.35,21.59 R1.2 | v27.69,22.61 28.7,23.62 U$3.P$1 28.7,25.4 31.24,27.94 33.02,27.94 SV2.6 | U$5.P$3 v43.43,16.51 | 49.53,9.14 51.05,7.62 v51.31,7.62 | 49.53,9.14 48.26,10.41 C6.1 | v39.12,19.05 37.85,20.32
  pour Route15: 34.29,27.94 34.29,3.81 59.69,3.81 59.69,27.94
VSS  (via drill 0.61)
  Top 0.254: C8.2 58.93,11.43 59.44,10.92 59.44,10.67 v60.2,9.91 60.71,9.4 60.71,5.84 59.94,5.08 LRX.C | 55.37,27.94 IC1.4 54.86,27.94 | 50.55,27.94 IC1.2 | 50.55,27.94 54.86,27.94 | U$1.6 36.32,17.78 36.32,18.54 U$1.5 36.07,18.54 33.02,18.54 v32.77,18.8 | v26.42,22.35 27.18,21.59 27.18,20.07 U$6.P9 | v57.66,14.48 56.39,14.48 U$4.10 | LEXE.C 49.78,6.86 48.77,5.84 44.96,5.84 43.18,7.62 43.18,10.16 42.67,10.67 42.42,10.67 41.91,11.18 41.91,11.94 U$1.17 41.91,12.19 41.91,14.99 39.62,17.11 39.62,17.97 41.91,20.57 41.91,23.37 U$1.39 41.91,23.62 41.91,24.64 39.37,27.18 39.37,27.69 38.86,28.19 | C5.2 29.21,6.6 29.72,6.6 31.24,5.08 33.02,5.08 SV1.4 36.83,3.81 42.93,3.81 44.2,2.54 L5V.C | 38.1,28.96 34.54,28.96 SV2.4 | v49.53,17.02 47.75,17.02 U$1.27 | 38.86,28.19 38.1,28.96 | 38.1,28.96 C4.2 | 50.55,27.94 50.55,30.99 50.29,31.24 41.91,31.24 38.86,28.19 | 54.86,27.94 57.91,30.99 C7.2 | LTX.C 59.94,3.56 59.94,3.65
  Top 0.61: 59.94,3.65 59.94,5.08
  Bottom 0.254: 45.47,14.99 44.7,14.99 IC2.4 | 45.97,14.99 45.47,14.99 | 45.47,14.99 IC2.3 | 45.97,14.99 46.74,14.99 IC2.1 | 45.97,15.24 45.97,14.99 | 45.97,15.24 45.97,16.76 | 45.97,16.76 45.97,20.57 IC2.7 45.97,20.83 45.97,21.34 46.74,22.1 46.74,23.62 | 45.97,14.99 IC2.2 | U$5.P$4 45.97,15.24 | 45.97,15.24 IC2.2 | C6.2 48.26,12.45 45.97,14.73 IC2.2 | v32.77,18.8 34.29,18.8 C3.2 | U$3.P$4 28.7,15.49 26.67,13.46 U$2.P$3 | 45.97,16.76 v45.72,16.76 | 46.74,23.62 48.77,23.62 49.02,23.88 49.02,25.91 50.04,26.92 50.29,26.92 50.8,27.43 C1.2 | 46.74,23.62 44.96,25.4 X1.GND
  pour Route2: 23.81,31.75 23.81,1.27 63.5,1.27 63.5,31.75